# EasyEDA Pro project tc264核心板miniv3.1.epro

# Schematic Schematic3
Board Name: 芯片小板; Create Date: 2025-07-16; Page Name: P1; Project Name: tc264芯片小板; Schematic Name: Schematic3; Update Date: 2025-07-17; Company: 嘉立创EDA; Page Size: A4; Version: V1.0
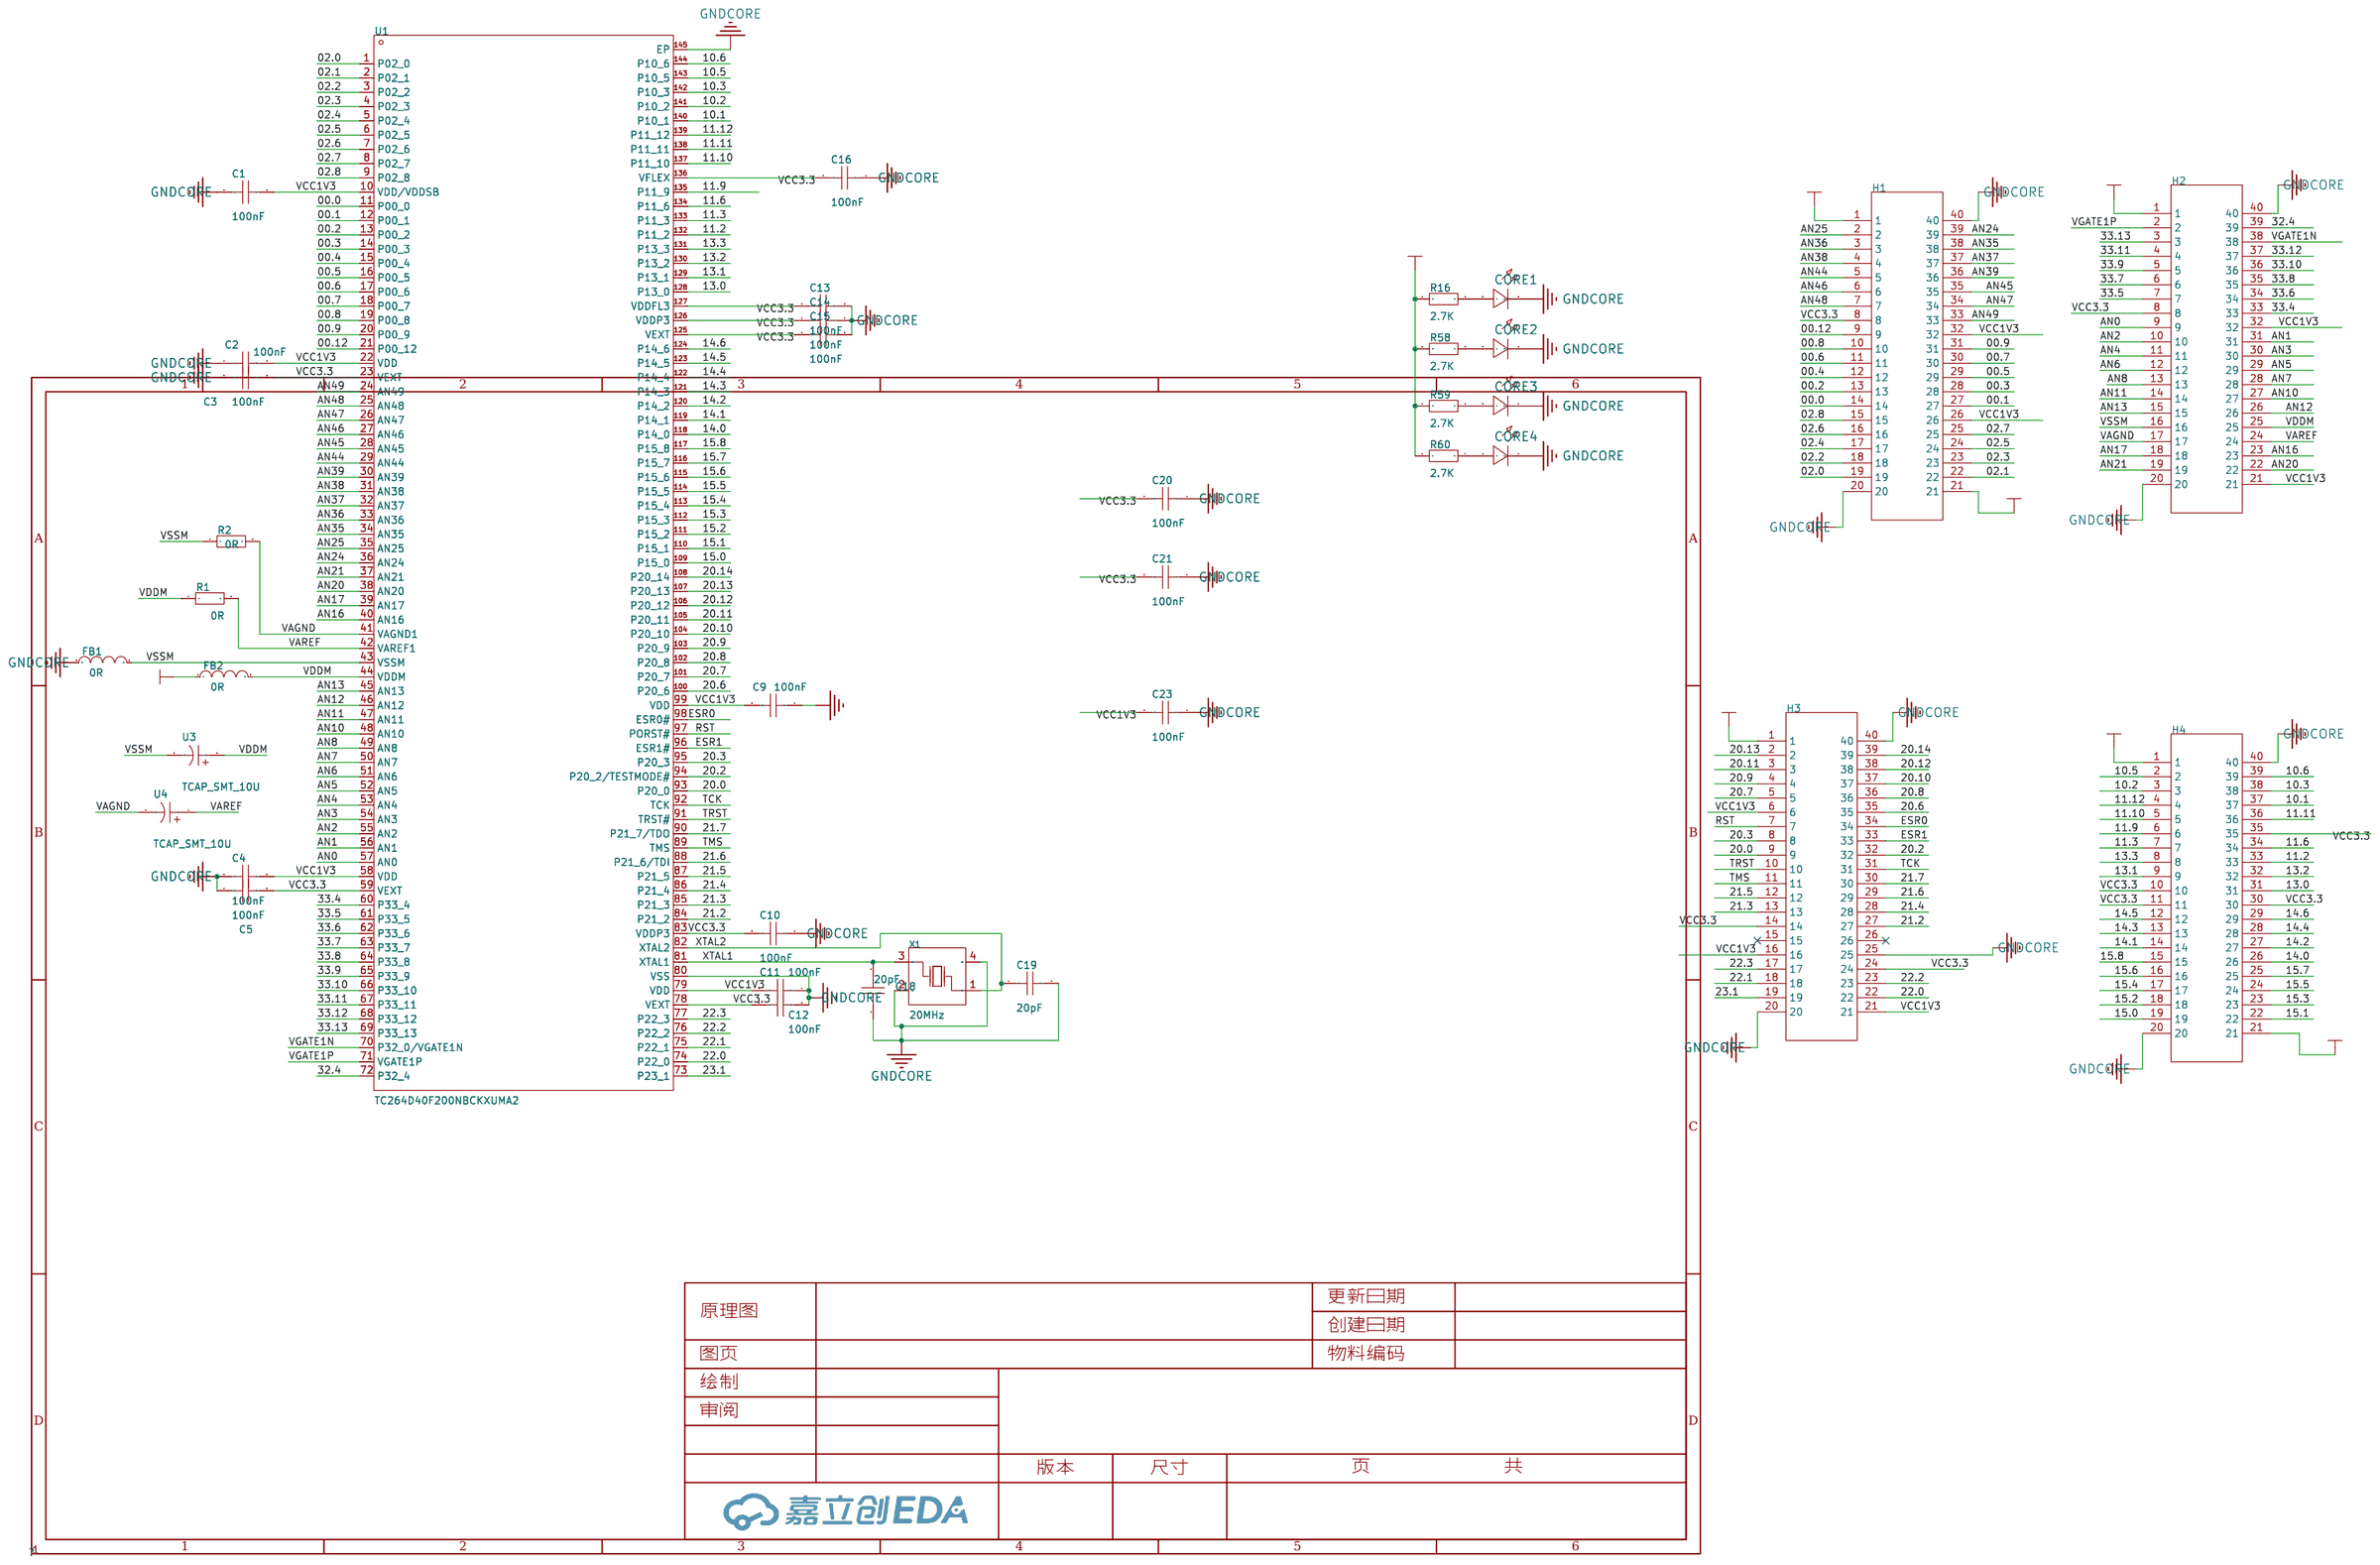
[diagram p0: schematic sheet]

## Parts
C1  100nF  [C0603]
C2  100nF  [C0603]
C3  100nF  [C0603]
C4  100nF  [C0603]
C5  100nF  [C0603]
C9  100nF  [C0603]
C10  100nF  [C0603]
C11  100nF  [C0603]
C12  100nF  [C0603]
C13  100nF  [C0603]
C14  100nF  [C0603]
C15  100nF  [C0603]
C16  100nF  [C0603]
C18  20pF  [C0603]
C19  20pF  [C0603]
C20  100nF  [C0603]
C21  100nF  [C0603]
C23  100nF  [C0603]
CORE1  -  [LED_0603]
CORE2  -  [LED_0603]
CORE3  -  [LED_0603]
CORE4  -  [LED_0603]
FB1  0R  [L0603]
FB2  0R  [L0603]
H1  -  [HEADER_0.8mm_2x20P_G]
H2  -  [HEADER_0.8mm_2x20P_G]
H3  -  [HEADER_0.8mm_2x20P_G]
H4  -  [HEADER_0.8mm_2x20P_G]
R1  0R  [R0603]
R2  0R  [R0603]
R16  2.7K  [R0603]
R58  2.7K  [R0603]
R59  2.7K  [R0603]
R60  2.7K  [R0603]
U1  TC264D40F200NBCKXUMA2  [LQFP-144_L20.0-W20.0-P0.50-LS22.0-BL-EP6.7]
U3  TCAP_SMT_10U  [CAP-SMD_L3.2-W1.6-FD-1]
U4  TCAP_SMT_10U  [CAP-SMD_L3.2-W1.6-FD-1]
X1  20MHz  [OSC-SMD_4P-L3.2-W2.5-BL]

## Library data of the parts
C1-C5 C9-C16 C18-C21 C23 = CAP_0603: Supplier Footprint: 0603
CORE1-CORE4 = LED_0603-R: Supplier Footprint: 0603
FB1 FB2 = BLM18PG121SN1D: 标称阻抗@测试频率:120Ω@100MHz;误差:±25%;直流电阻(RDC):50mΩ;额定电流:2A;电路数:1;; LCSC Part Name: 120Ω@100MHz ±25%; Supplier Part: C14709; Manufacturer: muRata(村田); Supplier Footprint: 0603; JLCPCB Part Class: 扩展库; Datasheet: https://atta.szlcsc.com/upload/public/pdf/source/20130704/1457706621134.pdf; Supplier: LCSC; Impedance @ Frequency: 120Ω@100MHz; Tolerance: ±25%; DC Resistance: 50mΩ; Current Rating: 2A; Circuits: 1
H1-H4 = HEADER_0.8mm_2x20P_G
R1 R2 R16 R58-R60 = Res_0603: Supplier Footprint: 0603
U1 = TC264D40F200NBCKXUMA2: CPU内核:其他系列;CPU最大主频:20MHz;工作电压范围:3.3V~5V;GPIO端口数量:88;; Supplier Part: C3232186; Manufacturer: Infineon(英飞凌); Supplier Footprint: LQFP-144-EP(20x20); JLCPCB Part Class: 扩展库; Supplier: LCSC; CPU Core: 其他系列; CPU Maximum Speed: 20MHz; Operating Voltage Range: 3.3V~5V; GPIO Ports Number: 88; ADC (Bit): 12bit; Secure Digital Input and Output: 有; Operating Temperature Range: -40℃~+125℃
U3 U4 = TCAP_SMT_10U: Supplier Part: C9900021659; Supplier Footprint: 钽电容1206; JLCPCB Part Class: 扩展库; Supplier: LCSC
X1 = X322512MSB4SI: 频率:12MHz;频率公差:±10ppm;负载电容:20pF;; LCSC Part Name: 12MHz ±10ppm 20pF YSX321SL; Supplier Part: C9002; Manufacturer: YXC(扬兴晶振); Supplier Footprint: SMD3225-4P; JLCPCB Part Class: 基础库; Datasheet: https://atta.szlcsc.com/upload/public/pdf/source/20210329/C112971_1F611BDC486E193C1706F6D8EB5AA189.pdf; Supplier: LCSC; Crystal Type: 贴片无源晶振; Frequency Tolerance: ±10ppm; Frequency Stability: ±30ppm; Load Capacitance: 20pF; Operating Temperature: -40℃~+85℃

## Nets
GNDCORE: C1.1 C2.1 C3.1 C4.1 C5.1 C9.1 C10.1 C11.1 C12.1 C13.1 C14.1 C15.1 C16.1 C18.1 C19.2 C20.1 C21.1 C23.1 CORE1.1(C) CORE2.1(C) CORE3.1(C) CORE4.1(C) FB1.1 H1.20 H1.40 H2.20 H2.40 H3.20 H3.25 H3.40 H4.20 H4.40 U1.80(VSS) U1.145(EP) X1.2(GND) X1.4(GND)
VCC1V3: C1.2 C2.2 C4.2 C9.2 C11.2 C23.2 H1.26 H1.32 H2.1 H2.21 H2.32 H3.6 H3.16 H3.21 U1.10(VDD/VDDSB) U1.22(VDD) U1.58(VDD) U1.79(VDD) U1.99(VDD)
VCC3.3: C3.2 C5.2 C10.2 C12.2 C13.2 C14.2 C15.2 C16.2 C20.2 C21.2 FB2.1 H1.1 H1.8 H1.21 H2.8 H3.1 H3.14 H3.24 H4.1 H4.10 H4.11 H4.21 H4.30 H4.35 R16.1 R58.1 R59.1 R60.1 U1.23(VEXT) U1.59(VEXT) U1.78(VEXT) U1.83(VDDP3) U1.125(VEXT) U1.126(VDDP3) U1.127(VDDFL3) U1.136(VFLEX)
VDDM: FB2.2 H2.25 R1.1 U1.44(VDDM) U3.1
VSSM: FB1.2 H2.16 R2.1 U1.43(VSSM) U3.2
00.0: H1.14 U1.11(P00_0)
00.1: H1.27 U1.12(P00_1)
00.2: H1.13 U1.13(P00_2)
00.3: H1.28 U1.14(P00_3)
00.4: H1.12 U1.15(P00_4)
00.5: H1.29 U1.16(P00_5)
00.6: H1.11 U1.17(P00_6)
00.7: H1.30 U1.18(P00_7)
00.8: H1.10 U1.19(P00_8)
00.9: H1.31 U1.20(P00_9)
00.12: H1.9 U1.21(P00_12)
02.0: H1.19 U1.1(P02_0)
02.1: H1.22 U1.2(P02_1)
02.2: H1.18 U1.3(P02_2)
02.3: H1.23 U1.4(P02_3)
02.4: H1.17 U1.5(P02_4)
02.5: H1.24 U1.6(P02_5)
02.6: H1.16 U1.7(P02_6)
02.7: H1.25 U1.8(P02_7)
02.8: H1.15 U1.9(P02_8)
10.1: H4.37 U1.140(P10_1)
10.2: H4.3 U1.141(P10_2)
10.3: H4.38 U1.142(P10_3)
10.5: H4.2 U1.143(P10_5)
10.6: H4.39 U1.144(P10_6)
11.2: H4.33 U1.132(P11_2)
11.3: H4.7 U1.133(P11_3)
11.6: H4.34 U1.134(P11_6)
11.9: H4.6 U1.135(P11_9)
11.10: H4.5 U1.137(P11_10)
11.11: H4.36 U1.138(P11_11)
11.12: H4.4 U1.139(P11_12)
13.0: H4.31 U1.128(P13_0)
13.1: H4.9 U1.129(P13_1)
13.2: H4.32 U1.130(P13_2)
13.3: H4.8 U1.131(P13_3)
14.0: H4.26 U1.118(P14_0)
14.1: H4.14 U1.119(P14_1)
14.2: H4.27 U1.120(P14_2)
14.3: H4.13 U1.121(P14_3)
14.4: H4.28 U1.122(P14_4)
14.5: H4.12 U1.123(P14_5)
14.6: H4.29 U1.124(P14_6)
15.0: H4.19 U1.109(P15_0)
15.1: H4.22 U1.110(P15_1)
15.2: H4.18 U1.111(P15_2)
15.3: H4.23 U1.112(P15_3)
15.4: H4.17 U1.113(P15_4)
15.5: H4.24 U1.114(P15_5)
15.6: H4.16 U1.115(P15_6)
15.7: H4.25 U1.116(P15_7)
15.8: H4.15 U1.117(P15_8)
20.0: H3.9 U1.93(P20_0)
20.2: H3.32 U1.94(P20_2/TESTMODE#)
20.3: H3.8 U1.95(P20_3)
20.6: H3.35 U1.100(P20_6)
20.7: H3.5 U1.101(P20_7)
20.8: H3.36 U1.102(P20_8)
20.9: H3.4 U1.103(P20_9)
20.10: H3.37 U1.104(P20_10)
20.11: H3.3 U1.105(P20_11)
20.12: H3.38 U1.106(P20_12)
20.13: H3.2 U1.107(P20_13)
20.14: H3.39 U1.108(P20_14)
21.2: H3.27 U1.84(P21_2)
21.3: H3.13 U1.85(P21_3)
21.4: H3.28 U1.86(P21_4)
21.5: H3.12 U1.87(P21_5)
21.6: H3.29 U1.88(P21_6/TDI)
21.7: H3.30 U1.90(P21_7/TDO)
22.0: H3.22 U1.74(P22_0)
22.1: H3.18 U1.75(P22_1)
22.2: H3.23 U1.76(P22_2)
22.3: H3.17 U1.77(P22_3)
23.1: H3.19 U1.73(P23_1)
32.4: H2.39 U1.72(P32_4)
33.4: H2.33 U1.60(P33_4)
33.5: H2.7 U1.61(P33_5)
33.6: H2.34 U1.62(P33_6)
33.7: H2.6 U1.63(P33_7)
33.8: H2.35 U1.64(P33_8)
33.9: H2.5 U1.65(P33_9)
33.10: H2.36 U1.66(P33_10)
33.11: H2.4 U1.67(P33_11)
33.12: H2.37 U1.68(P33_12)
33.13: H2.3 U1.69(P33_13)
AN0: H2.9 U1.57(AN0)
AN1: H2.31 U1.56(AN1)
AN2: H2.10 U1.55(AN2)
AN3: H2.30 U1.54(AN3)
AN4: H2.11 U1.53(AN4)
AN5: H2.29 U1.52(AN5)
AN6: H2.12 U1.51(AN6)
AN7: H2.28 U1.50(AN7)
AN8: H2.13 U1.49(AN8)
AN10: H2.27 U1.48(AN10)
AN11: H2.14 U1.47(AN11)
AN12: H2.26 U1.46(AN12)
AN13: H2.15 U1.45(AN13)
AN16: H2.23 U1.40(AN16)
AN17: H2.18 U1.39(AN17)
AN20: H2.22 U1.38(AN20)
AN21: H2.19 U1.37(AN21)
AN24: H1.39 U1.36(AN24)
AN25: H1.2 U1.35(AN25)
AN35: H1.38 U1.34(AN35)
AN36: H1.3 U1.33(AN36)
AN37: H1.37 U1.32(AN37)
AN38: H1.4 U1.31(AN38)
AN39: H1.36 U1.30(AN39)
AN44: H1.5 U1.29(AN44)
AN45: H1.35 U1.28(AN45)
AN46: H1.6 U1.27(AN46)
AN47: H1.34 U1.26(AN47)
AN48: H1.7 U1.25(AN48)
AN49: H1.33 U1.24(AN49)
ESR0: H3.34 U1.98(ESR0#)
ESR1: H3.33 U1.96(ESR1#)
RST: H3.7 U1.97(PORST#)
TCK: H3.31 U1.92(TCK)
TMS: H3.11 U1.89(TMS)
TRST: H3.10 U1.91(TRST#)
VAGND: H2.17 R2.2 U1.41(VAGND1) U4.2
VAREF: H2.24 R1.2 U1.42(VAREF1) U4.1
VGATE1N: H2.38 U1.70(P32_0/VGATE1N)
VGATE1P: H2.2 U1.71(VGATE1P)
XTAL1: C18.2 U1.81(XTAL1) X1.3(OSC2)
XTAL2: C19.1 U1.82(XTAL2) X1.1(OSC1)
$1N2544: CORE1.2(A) R16.2
$1N12255: CORE2.2(A) R58.2
$1N12320: CORE3.2(A) R59.2
$1N12385: CORE4.2(A) R60.2

Not connected (* = marked no-connect by the designer): H3 15* 26*

# Board PCB8
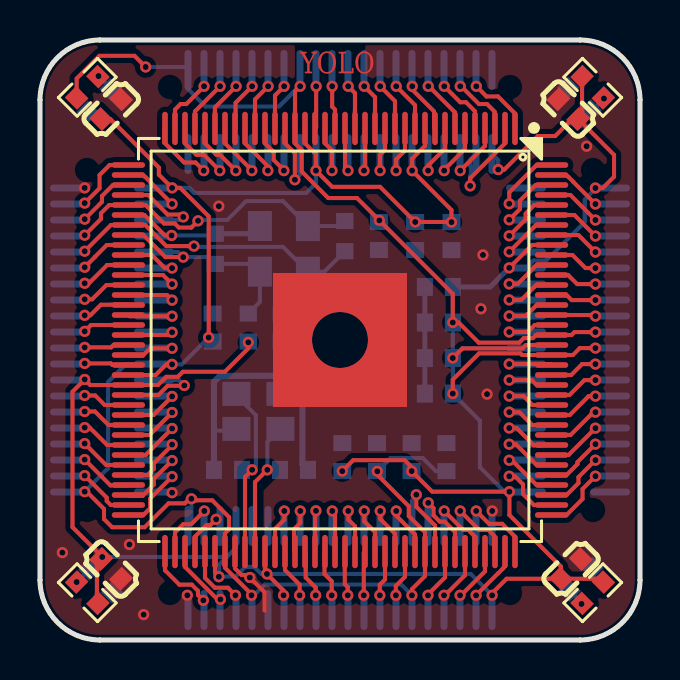
[diagram p1: board, top side]
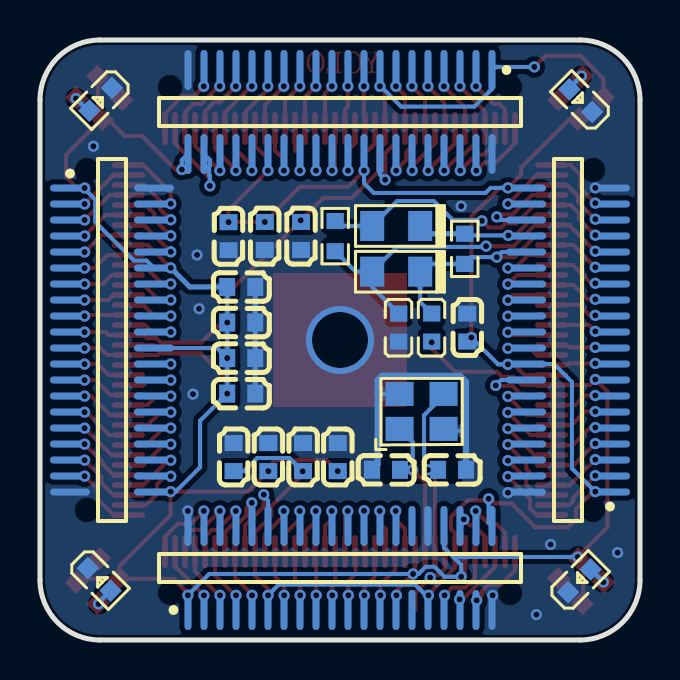
[diagram p2: board, bottom side, seen from below]

Outline 30 x 30 mm; copper layers: Top Layer, Bottom Layer. Coordinates in mm from the lower left corner of the outline.
Outline path: 0,27 0,3 arc(0.88,0.88) 3,0 27,0 arc(29.12,0.88) 30,3 30,27 arc(29.12,29.12) 27,30 3,30 arc(0.88,29.12) 0,27
Stack: Top Layer 0.035mm / Dielectric1 1.51mm FR4 er 4.5 / Bottom Layer 0.035mm

## Design rules (mm)
template: 自定义配置
spacing copperThickness1oz (default): track to track 0.102, other pairs 0.152 to 0.3
spacing copperThickness2oz: track to track 0.203, other pairs 0.152 to 0.3
track width copperThickness1oz (default): min 0.127, default 0.203, max 2.54
track width copperThickness2oz: min 0.203, default 0.254, max 2.54
differential pair differentialPair (default): width min 0.127, default 0.254, max 2.54; gap min 0.152, default 0.152
via viaSize (default): diameter min 0.5, default 0.559, max 10; hole min 0.3, default 0.305, max 6.299

## Placement (name value [footprint] x y rotation side)
C1  100nF  [C0603]  20.57 20.19 90 bottom
C2  100nF  [C0603]  18.76 20.2 90 bottom
C3  100nF  [C0603]  16.95 20.2 90 bottom
C4  100nF  [C0603]  8.64 15.62 270 bottom
C5  100nF  [C0603]  3.56 3.56 135 top
C9  100nF  [C0603]  20.32 9.14 270 bottom
C10  100nF  [C0603]  18.58 9.14 270 bottom
C11  100nF  [C0603]  16.85 9.14 270 bottom
C12  100nF  [C0603]  15.11 9.14 270 bottom
C13  100nF  [C0603]  19.94 12.32 0 bottom
C14  100nF  [C0603]  19.94 14.1 0 bottom
C15  100nF  [C0603]  19.94 15.88 0 bottom
C16  100nF  [C0603]  19.94 17.65 0 bottom
C18  20pF  [C0603]  9.4 8.51 0 bottom
C19  20pF  [C0603]  12.7 8.51 0 bottom
C20  100nF  [C0603]  26.54 3.56 225 top
C21  100nF  [C0603]  26.42 26.54 315 top
C23  100nF  [C0603]  3.56 26.54 225 top
CORE1  -  [LED_0603]  3 3 135 bottom
CORE2  -  [LED_0603]  27 27 315 bottom
CORE3  -  [LED_0603]  27 3 225 bottom
CORE4  -  [LED_0603]  3 27 44.9 bottom
FB1  0R  [L0603]  12.06 15.62 90 bottom
FB2  0R  [L0603]  10.41 15.62 90 bottom
H1  -  [HEADER_0.8mm_2x20P_G]  15 26.4 270 bottom
H2  -  [HEADER_0.8mm_2x20P_G]  3.6 15 0 bottom
H3  -  [HEADER_0.8mm_2x20P_G]  15 3.6 90 bottom
H4  -  [HEADER_0.8mm_2x20P_G]  26.4 15 180 bottom
R1  0R  [R0603]  8.76 19.56 90 bottom
R2  0R  [R0603]  15.24 20.19 90 bottom
R16  2.7K  [R0603]  2.37 2.36 135 top
R58  2.7K  [R0603]  27.63 27.64 315 top
R59  2.7K  [R0603]  27.63 2.36 225 top
R60  2.7K  [R0603]  2.37 27.64 45 top
U1  TC264D40F200NBCKXUMA2  [LQFP-144_L20.0-W20.0-P0.50-LS22.0-BL-EP6.7]  15 15 180 top
U3  TCAP_SMT_10U  [CAP-SMD_L3.2-W1.6-FD-1]  12.19 18.42 0 bottom
U4  TCAP_SMT_10U  [CAP-SMD_L3.2-W1.6-FD-1]  12.19 20.7 0 bottom
X1  20MHz  [OSC-SMD_4P-L3.2-W2.5-BL]  10.92 11.43 180 bottom

## Footprints (pads in the part's own frame, mm; a bottom-side part is the same pattern mirrored in y, then rotated)
C0603
  rect 0.8x0.9 smd: 1(-0.7,0) 2(0.7,0)
CAP-SMD_L3.2-W1.6-FD-1
  rect 1.2x1.5 smd: 1(-1.2,0) 2(1.2,0)
HEADER_0.8mm_2x20P_G
  oval 2x0.35 smd: 1(-2.1,7.6) 2(-2.1,6.8) 3(-2.1,6) 4(-2.1,5.2) 5(-2.1,4.4) 6(-2.1,3.6) 7(-2.1,2.8) 8(-2.1,2) 9(-2.1,1.2) 10(-2.1,0.4) 11(-2.1,-0.4) 12(-2.1,-1.2) 13(-2.1,-2) 14(-2.1,-2.8) 15(-2.1,-3.6) 16(-2.1,-4.4) 17(-2.1,-5.2) 18(-2.1,-6) 19(-2.1,-6.8) 20(-2.1,-7.6) 21(2.1,-7.6) 22(2.1,-6.8) 23(2.1,-6) 24(2.1,-5.2) 25(2.1,-4.4) 26(2.1,-3.6) 27(2.1,-2.8) 28(2.1,-2) 29(2.1,-1.2) 30(2.1,-0.4) 31(2.1,0.4) 32(2.1,1.2) 33(2.1,2) 34(2.1,2.8) 35(2.1,3.6) 36(2.1,4.4) 37(2.1,5.2) 38(2.1,6) 39(2.1,6.8) 40(2.1,7.6)
L0603
  rect 0.8x0.864 smd: 1(-0.7,0) 2(0.7,0)
LED_0603
  rect 0.8x0.8 smd: 1(-0.851,-0.01) 2(0.75,-0.005)
LQFP-144_L20.0-W20.0-P0.50-LS22.0-BL-EP6.7
  oval 0.28x1.66 smd: 1(-8.75,-10.58) 2(-8.25,-10.58) 3(-7.75,-10.58) 4(-7.25,-10.58) 5(-6.75,-10.58) 6(-6.25,-10.58) 7(-5.75,-10.58) 8(-5.25,-10.58) 9(-4.75,-10.58) 10(-4.25,-10.58) 11(-3.75,-10.58) 12(-3.25,-10.58) 13(-2.75,-10.58) 14(-2.25,-10.58) 15(-1.75,-10.58) 16(-1.25,-10.58) 17(-0.75,-10.58) 18(-0.25,-10.58) 19(0.25,-10.58) 20(0.75,-10.58) 21(1.25,-10.58) 22(1.75,-10.58) 23(2.25,-10.58) 24(2.75,-10.58) 25(3.25,-10.58) 26(3.75,-10.58) 27(4.25,-10.58) 28(4.75,-10.58) 29(5.25,-10.58) 30(5.75,-10.58) 31(6.25,-10.58) 32(6.75,-10.58) 33(7.25,-10.58) 34(7.75,-10.58) 35(8.25,-10.58) 36(8.75,-10.58) 73(8.75,10.58) 74(8.25,10.58) 75(7.75,10.58) 76(7.25,10.58) 77(6.75,10.58) 78(6.25,10.58) 79(5.75,10.58) 80(5.25,10.58) 81(4.75,10.58) 82(4.25,10.58) 83(3.75,10.58) 84(3.25,10.58) 85(2.75,10.58) 86(2.25,10.58) 87(1.75,10.58) 88(1.25,10.58) 89(0.75,10.58) 90(0.25,10.58) 91(-0.25,10.58) 92(-0.75,10.58) 93(-1.25,10.58) 94(-1.75,10.58) 95(-2.25,10.58) 96(-2.75,10.58) 97(-3.25,10.58) 98(-3.75,10.58) 99(-4.25,10.58) 100(-4.75,10.58) 101(-5.25,10.58) 102(-5.75,10.58) 103(-6.25,10.58) 104(-6.75,10.58) 105(-7.25,10.58) 106(-7.75,10.58) 107(-8.25,10.58) 108(-8.75,10.58)
  oval 1.66x0.28 smd: 37(10.58,-8.75) 38(10.58,-8.25) 39(10.58,-7.75) 40(10.58,-7.25) 41(10.58,-6.75) 42(10.58,-6.25) 43(10.58,-5.75) 44(10.58,-5.25) 45(10.58,-4.75) 46(10.58,-4.25) 47(10.58,-3.75) 48(10.58,-3.25) 49(10.58,-2.75) 50(10.58,-2.25) 51(10.58,-1.75) 52(10.58,-1.25) 53(10.58,-0.75) 54(10.58,-0.25) 55(10.58,0.25) 56(10.58,0.75) 57(10.58,1.25) 58(10.58,1.75) 59(10.58,2.25) 60(10.58,2.75) 61(10.58,3.25) 62(10.58,3.75) 63(10.58,4.25) 64(10.58,4.75) 65(10.58,5.25) 66(10.58,5.75) 67(10.58,6.25) 68(10.58,6.75) 69(10.58,7.25) 70(10.58,7.75) 71(10.58,8.25) 72(10.58,8.75) 109(-10.58,8.75) 110(-10.58,8.25) 111(-10.58,7.75) 112(-10.58,7.25) 113(-10.58,6.75) 114(-10.58,6.25) 115(-10.58,5.75) 116(-10.58,5.25) 117(-10.58,4.75) 118(-10.58,4.25) 119(-10.58,3.75) 120(-10.58,3.25) 121(-10.58,2.75) 122(-10.58,2.25) 123(-10.58,1.75) 124(-10.58,1.25) 125(-10.58,0.75) 126(-10.58,0.25) 127(-10.58,-0.25) 128(-10.58,-0.75) 129(-10.58,-1.25) 130(-10.58,-1.75) 131(-10.58,-2.25) 132(-10.58,-2.75) 133(-10.58,-3.25) 134(-10.58,-3.75) 135(-10.58,-4.25) 136(-10.58,-4.75) 137(-10.58,-5.25) 138(-10.58,-5.75) 139(-10.58,-6.25) 140(-10.58,-6.75) 141(-10.58,-7.25) 142(-10.58,-7.75) 143(-10.58,-8.25) 144(-10.58,-8.75)
  rect 6.7x6.7 smd: 145(0,0)
OSC-SMD_4P-L3.2-W2.5-BL
  rect 1.4x1.2 smd: 1(-1.1,-0.875) 2(1.1,-0.875) 3(1.1,0.875) 4(-1.1,0.875)
R0603
  rect 0.806x0.864 smd: 1(-0.753,0) 2(0.753,0)

## Nets
As in the schematic.

Pads without a net: H3 15 26

## Via types
v1: diameter 0.559, hole 0.305, Top Layer to Bottom Layer, 182 vias
v2: diameter 3.4, hole 2.8, Top Layer to Bottom Layer, 1 via

## Routing (per net, layer and track width the routed paths; a pad name or vN(x,y) marks a point on that pad's centre or on a via; arc(x,y) is an arc through that point)
GNDCORE: length 27.2
  Top Layer w0.203: 11.23,1.47 11.23,2.39 v1(10.49,3.12) 10.37,3.25 10.08,3.25 9.75,3.58 U1.80
  Bottom Layer w0.203: v1(7.37,2.23) 7.4,2.2 H3.20 ; 13.12,12.31 13.12,12.31 X1.4 ; 8.7,10.46 9.73,10.46 X1.2 ; v1(22.61,6.45) 22.61,5.71 H3.40
  Bottom Layer w0.254: v1(2.24,22.61) 2.23,22.6 H2.20 ; C16.1 C15.1 C14.1 C13.1
  Bottom Layer w0.305: C19.2 13.12,8.79 13.12,12.99 12.9,13.21 9,13.21 8.7,12.91 C18.1
  vias: v1(1.12,4.37) v1(4.47,4.78) v1(5.18,1.27) v1(6.6,7.37) v1(8.94,21.69) v1(22.05,16.56) v1(22.15,19.25) v1(22.35,12.29) v1(27.33,24.69) v2(15,15)
VCC1V3: length 90.4
  Top Layer w0.203: v1(8.43,15.12) 8.44,15.13 8.44,21.18 7.01,22.61 v1(6.6,22.61) 5.94,23.27 5.94,23.62 3.52,26.05 3.06,26.05 ; v1(6.6,13.78) 6.31,13.78 5.78,13.25 U1.58 ; 7.49,7.04 7.54,7.04 v1(7.57,7.06) ; 7.49,7.04 7.44,6.98 ; 7.49,7.04 7.44,7.04 ; 7.44,7.04 7.24,6.83 6.43,6.83 5.23,5.64 3.61,5.64 3.2,6.05 3.2,6.55 2.34,7.42 v1(2.24,7.42) ; 7.44,7.04 7.44,6.98 ; v1(18.6,2.23) 18.6,2.54 19.25,3.2 U1.99 19.25,5.39 18.44,6.2 18.44,6.69 16.87,8.26 v1(16.87,8.43) ; 7.44,6.98 8.61,6.98 9.45,6.14 9.45,5.54 9.25,5.34 U1.79 9.25,3.61 10.57,2.29 v1(10.57,2.23) ; U1.10 19.25,24.71 18.61,24.07 v1(18.61,23.47) 20.57,21.5 v1(20.57,20.89) 20.57,20.9 v1(18.76,20.9) 17,22.66 14.61,22.66 v1(13.8,23.47) 13.8,24.29 13.25,24.83 U1.22
  Bottom Layer w0.203: H1.26 18.61,24.29 v1(18.61,23.47) ; v1(8.43,15.12) 7.09,13.78 v1(6.6,13.78) ; H3.16 10.6,2.21 v1(10.57,2.23) 10.7,2.23 11.24,2.77 18.06,2.77 v1(18.6,2.23) 18.6,2.23 H3.6 ; v1(7.57,7.06) 7.57,5.87 H3.21 ; C11.2 16.85,8.44 v1(16.87,8.43) 17.53,9.1 19.14,9.1 19.79,8.44 C9.2 ; H2.32 4.3,13.8 3.4,12.9 3.4,8.58 v1(2.24,7.42) ; H1.32 13.8,23.47 v1(13.8,23.47) 13.8,22.84 13.31,22.35 7.72,22.35 7.47,22.61 v1(6.6,22.61)
  Bottom Layer w0.254: H2.1 2.22,7.4 v1(2.24,7.42)
VCC3.3: length 166.8
  Top Layer w0.203: 12.75,24.92 12.75,24.84 13.09,24.5 13.09,23.42 14.41,22.1 15.85,22.1 v1(16.97,20.98) 20.64,17.31 v1(20.64,15.88) 20.93,15.88 21.93,14.87 23.96,14.87 24.19,15.1 24.65,15.1 24.8,15.25 U1.127 26.58,15.25 26.72,15.39 v1(27.77,15.39) ; R60.1 1.83,28.07 2.97,29.21 4.72,29.21 v1(5.28,28.65) ; U1.136 24.6,19.75 v1(23.46,18.61) ; v1(8.94,3.16) 8.75,3.36 U1.78 ; 26.91,26.05 26.61,26.05 25.76,25.2 24.89,25.2 23.22,23.52 v1(22.91,23.52) ; 26.91,26.05 28.7,24.26 28.7,23.17 28.14,22.6 v1(27.77,22.6) ; 26.91,26.05 27.1,26.24 R58.1 ; R16.1 2.84,1.89 2.84,3.89 v1(3.11,4.15) 1.63,5.64 1.63,12.42 v1(2.24,13.03) 2.51,12.75 U1.59 5.9,12.75 6.31,13.16 6.89,13.16 7.14,13.41 9.25,13.41 10.41,14.58 v1(10.41,14.88) ; 26.05,3.06 23.32,3.06 22.55,2.29 v1(22.61,2.23) ; 26.05,3.06 26.05,3.67 23.47,6.25 v1(23.47,7.42) 19.61,7.42 v1(18.58,8.44) 18.58,8.64 18.24,8.99 15.66,8.99 v1(15.11,8.44) ; 26.05,3.06 28,3.06 R59.1 ; v1(12.18,2.23) 12.18,2.47 v1(11.35,3.3) 11.25,3.4 U1.83 ; U1.126 24.3,14.75 24.13,14.58 21.12,14.58 v1(20.64,14.1) ; U1.23 12.75,27.43 v1(13.01,27.69) ; v1(27.77,14.59) 26.99,14.59 26.65,14.25 U1.125 24.1,14.25 24.02,14.33 21.95,14.33 20.64,13.02 v1(20.64,12.32)
  Bottom Layer w0.203: v1(23.46,18.61) 24.29,18.61 H4.35 24.67,18.97 25.3,18.97 27.24,20.91 27.24,22.02 27.77,22.55 v1(27.77,22.6) ; H4.30 21.14,14.6 v1(20.64,14.1) ; 9.33,4.15 8.94,3.76 v1(8.94,3.16) 9.78,3.16 10.27,3.66 10.71,3.66 11.07,3.3 v1(11.35,3.3) 21.54,3.3 v1(22.61,2.23) 22.61,1.51 H3.1 ; 9.33,4.15 v1(3.11,4.15) ; 9.33,4.15 9.8,4.62 H3.24 ; v1(20.64,14.1) v1(20.64,12.32) 22,10.96 22,8.64 23.22,7.42 v1(23.47,7.42) ; v1(20.64,14.1) v1(20.64,15.88) 20.64,17.65 ; H3.14 12.2,2.21 v1(12.18,2.23) ; H4.10 28.5,15.39 v1(27.77,15.39) ; H4.11 28.5,14.59 v1(27.77,14.59) ; H1.21 22.91,23.99 v1(22.91,23.52) ; v1(5.28,28.65) 7.25,28.65 H1.1 7.4,27.55 8.28,26.67 11.94,26.67 12.96,27.69 v1(13.01,27.69) 13.01,28.49 H1.8
  Bottom Layer w0.254: H2.8 2.21,13 v1(2.24,13.03) ; v1(23.46,18.61) 22.51,17.65 20.64,17.65
VDDM: length 11.2
  Top Layer w0.203: v1(7.16,19.14) 6.27,19.14 5.17,20.25 U1.44
  Bottom Layer w0.203: FB2.2 10.99,16.9 U3.1 10.6,18.8 R1.1 8.42,19.14 v1(7.16,19.14) 6.91,19.4 H2.25
VSSM: length 18.4
  Top Layer w0.203: v1(7.7,19.69) 6.32,19.69 5.26,20.75 U1.43 3.55,20.75 v1(2.24,19.44)
  Bottom Layer w0.203: U3.2 13.39,17.65 FB1.2 ; U3.2 14.22,18.42 R2.1 ; U3.2 12.15,19.65 7.7,19.65 v1(7.7,19.69)
  Bottom Layer w0.254: H2.16 2.2,19.4 v1(2.24,19.44)
00.0: length 3.3
  Top Layer w0.203: v1(17.81,27.69) 18.75,26.75 U1.11
  Bottom Layer w0.203: v1(17.81,27.69) 17.81,28.49 H1.14
00.1: length 3.1
  Top Layer w0.203: v1(17.8,23.47) 17.8,24.03 18.25,24.47 U1.12
  Bottom Layer w0.203: H1.27 17.8,24.3 v1(17.8,23.47)
00.2: length 3.2
  Top Layer w0.203: v1(17.01,27.69) 17.75,26.95 U1.13
  Bottom Layer w0.203: H1.13 17.01,28.49 v1(17.01,27.69)
00.3: length 3
  Top Layer w0.203: v1(17,23.47) 17,24.26 17.25,24.5 U1.14
  Bottom Layer w0.203: v1(17,23.47) 17,24.3 H1.28
00.4: length 3.1
  Top Layer w0.203: v1(16.21,27.69) 16.75,27.15 U1.15
  Bottom Layer w0.203: H1.12 16.21,28.49 v1(16.21,27.69)
00.5: length 3
  Top Layer w0.203: U1.16 16.25,23.52 v1(16.2,23.47)
  Bottom Layer w0.203: v1(16.2,23.47) H1.29
00.6: length 3.1
  Top Layer w0.203: U1.17 15.75,25.58 15.75,27.35 v1(15.41,27.69)
  Bottom Layer w0.203: v1(15.41,27.69) 15.41,28.49 H1.11
00.7: length 3
  Top Layer w0.203: U1.18 15.25,23.62 v1(15.4,23.47)
  Bottom Layer w0.203: v1(15.4,23.47) H1.30
00.8: length 2.2
  Top Layer w0.203: U1.19 14.75,26.53 14.61,26.67 v1(14.61,27.69)
00.9: length 3.1
  Top Layer w0.203: v1(14.6,23.47) 14.6,24.48 14.25,24.83 U1.20
  Bottom Layer w0.203: 14.6,23.47 H1.31
00.12: length 2.9
  Top Layer w0.203: v1(13.81,27.69) 13.81,25.64 U1.21
  Bottom Layer w0.203: H1.9 13.81,28.49 v1(13.81,27.69)
02.0: length 4.1
  Top Layer w0.203: U1.1 23.75,26.33 22.9,27.18 22.32,27.18 v1(21.81,27.69)
  Bottom Layer w0.203: H1.19 21.81,28.49 v1(21.81,27.69)
02.1: length 5.3
  Top Layer w0.203: v1(21.51,22.71) 21.51,23.09 23.25,24.83 U1.2
  Bottom Layer w0.203: H1.22 21.51,24.01 21.51,23.72 21.54,23.69 21.54,23.25 21.51,23.21 v1(21.51,22.71)
02.2: length 3.9
  Top Layer w0.203: v1(21.01,27.69) 21.06,27.69 21.95,26.8 22.35,26.8 22.73,26.42 22.73,25.6 U1.3
  Bottom Layer w0.203: H1.18 21.01,28.49 v1(21.01,27.69)
02.3: length 3.5
  Top Layer w0.203: v1(21.01,23.47) 22.25,24.71 U1.4
  Bottom Layer w0.203: H1.23 21.01,24.29 v1(21.01,23.47)
02.4: length 3.7
  Top Layer w0.203: U1.5 21.75,26.44 21.3,26.89 21.01,26.89 v1(20.21,27.69)
  Bottom Layer w0.203: v1(20.21,27.69) 20.21,28.49 H1.17
02.5: length 3.4
  Top Layer w0.203: 20.18,23.44 20.18,23.48 21.25,24.55 U1.6
  Bottom Layer w0.203: H1.24 20.21,24.29 v1(20.21,23.47)
02.6: length 3.5
  Top Layer w0.203: v1(19.41,27.69) 19.45,27.69 20.75,26.38 U1.7
  Bottom Layer w0.203: H1.16 19.41,28.49 v1(19.41,27.69)
02.7: length 3.3
  Top Layer w0.203: v1(19.41,23.47) 19.41,23.72 20.25,24.57 U1.8
  Bottom Layer w0.203: H1.25 19.41,24.29 v1(19.41,23.47)
02.8: length 3.4
  Top Layer w0.203: 18.61,27.52 18.61,27.49 ; 18.61,27.52 19.7,26.43 19.7,25.63 U1.9 ; 18.61,27.52 v1(18.61,27.69)
  Bottom Layer w0.203: v1(18.61,27.69) 18.61,28.49 H1.15
10.1: length 3.8
  Top Layer w0.203: U1.140 24.71,21.75 24.28,21.32 24.28,21.03 v1(23.46,20.21)
  Bottom Layer w0.203: H4.37 24.29,20.21 v1(23.46,20.21)
10.2: length 3.4
  Top Layer w0.203: U1.141 26.52,22.25 v1(27.77,21)
  Bottom Layer w0.203: v1(27.77,21) 28.5,21 H4.3
10.3: length 3.9
  Top Layer w0.203: U1.142 24.78,22.75 23.99,21.96 23.99,21.54 v1(23.46,21.01)
  Bottom Layer w0.203: 23.54,20.96 24.26,20.96 H4.38
10.5: length 3.5
  Top Layer w0.203: v1(27.77,21.8) 26.66,22.91 26.66,22.91 26.43,23.14 26.43,23.14 26.32,23.25 U1.143
  Bottom Layer w0.203: v1(27.77,21.8) 28.5,21.8
10.6: length 3.9
  Top Layer w0.203: v1(23.46,21.81) 23.46,22.38 24.83,23.75 U1.144
  Bottom Layer w0.203: 23.53,21.85 24.18,21.85 24.2,21.83
11.2: length 3.3
  Top Layer w0.203: v1(23.46,17) 24.06,17 24.81,17.75 U1.132
  Bottom Layer w0.203: v1(23.46,17) 24.3,17 H4.33
11.3: length 3.1
  Top Layer w0.203: U1.133 26.4,18.25 26.86,17.8 v1(27.77,17.8)
  Bottom Layer w0.203: H4.7 28.5,17.8 v1(27.77,17.8)
11.6: length 3.4
  Top Layer w0.203: U1.134 24.83,18.75 23.89,17.81 v1(23.46,17.81)
  Bottom Layer w0.203: H4.34 24.29,17.81 v1(23.46,17.81)
11.9: length 3.2
  Top Layer w0.203: U1.135 26.62,19.25 27.28,18.6 v1(27.77,18.6)
  Bottom Layer w0.203: H4.6 28.5,18.6 v1(27.77,18.6)
11.10: length 3.3
  Top Layer w0.203: v1(27.77,19.4) 26.92,20.25 U1.137
  Bottom Layer w0.203: H4.5 28.5,19.4 v1(27.77,19.4)
11.11: length 3.5
  Top Layer w0.203: v1(23.46,19.41) 24.8,20.75 U1.138
  Bottom Layer w0.203: v1(23.46,19.41) 24.29,19.41 H4.36
11.12: length 3.4
  Top Layer w0.203: U1.139 26.72,21.25 v1(27.77,20.2)
  Bottom Layer w0.203: v1(27.77,20.2) 28.5,20.2 H4.4
13.0: length 3.1
  Top Layer w0.203: U1.128 24.74,15.75 24.39,15.4 v1(23.46,15.4)
  Bottom Layer w0.203: v1(23.46,15.4) H4.31
13.1: length 2.9
  Top Layer w0.203: v1(27.77,16.2) 27.72,16.25 U1.129
  Bottom Layer w0.203: H4.9 28.5,16.2 v1(27.77,16.2)
13.2: length 3.2
  Top Layer w0.203: U1.130 24.83,16.75 24.28,16.2 v1(23.46,16.2)
  Bottom Layer w0.203: v1(23.46,16.2) 24.3,16.2
13.3: length 3
  Top Layer w0.203: v1(27.77,17) 26.58,17 26.31,17.27 25.6,17.27 U1.131
  Bottom Layer w0.203: v1(27.77,17) 28.5,17 H4.8
14.0: length 3.2
  Top Layer w0.203: U1.118 24.61,10.75 23.96,11.39 v1(23.46,11.39)
  Bottom Layer w0.203: v1(23.46,11.39) 24.29,11.39 H4.26
14.1: length 3.3
  Top Layer w0.203: U1.119 26.49,11.25 27.43,12.19 v1(27.77,12.19)
  Bottom Layer w0.203: v1(27.77,12.19) 28.49,12.19 H4.14
14.2: length 3.1
  Top Layer w0.203: v1(23.46,12.19) 24.18,12.19 24.62,11.75 U1.120
  Bottom Layer w0.203: v1(23.46,12.19) 24.29,12.19 H4.27
14.3: length 3.2
  Top Layer w0.203: v1(27.77,12.99) 27.22,12.99 26.47,12.25 U1.121
  Bottom Layer w0.203: v1(27.77,12.99) 28.49,12.99 H4.13
14.4: length 3.1
  Top Layer w0.203: 25.58,12.75 24.83,12.75 24.59,13 v1(23.46,13)
  Bottom Layer w0.203: v1(23.46,13) 24.3,13 H4.28
14.5: length 3.1
  Top Layer w0.203: U1.123 26.56,13.25 27.1,13.79 v1(27.77,13.79)
  Bottom Layer w0.203: v1(27.77,13.79) 28.49,13.79 H4.12
14.6: length 3
  Top Layer w0.203: U1.124 25.53,13.8 v1(23.46,13.8)
  Bottom Layer w0.203: v1(23.46,13.8) 24.3,13.8 H4.29
15.0: length 4
  Top Layer w0.203: U1.109 26.33,6.25 27.13,7.05 27.13,7.55 v1(27.77,8.19)
  Bottom Layer w0.203: v1(27.77,8.19) 28.49,8.19 H4.19
15.1: length 3.8
  Top Layer w0.203: v1(23.46,8.19) 23.75,8.19 24.15,7.78 24.15,7.29 24.69,6.75 U1.110
  Bottom Layer w0.203: H4.22 24.29,8.19 v1(23.46,8.19)
15.2: length 3.8
  Top Layer w0.203: U1.111 26.33,7.25 26.92,7.85 26.92,8.14 v1(27.77,8.99)
  Bottom Layer w0.203: v1(27.77,8.99) 28.49,8.99 H4.18
15.3: length 3.5
  Top Layer w0.203: U1.112 25.57,7.76 24.82,7.76 23.59,8.99 v1(23.46,8.99)
  Bottom Layer w0.203: H4.23 24.29,8.99 v1(23.46,8.99)
15.4: length 3.6
  Top Layer w0.203: v1(27.77,9.79) 26.87,8.89 26.87,8.8 26.31,8.23 25.6,8.23 U1.113
  Bottom Layer w0.203: H4.17 28.49,9.79 v1(27.77,9.79)
15.5: length 3.4
  Top Layer w0.203: U1.114 24.83,8.75 23.79,9.79 v1(23.46,9.79)
  Bottom Layer w0.203: v1(23.46,9.79) 24.29,9.79 H4.24
15.6: length 3.5
  Top Layer w0.203: v1(27.77,10.59) 26.43,9.25 U1.115
  Bottom Layer w0.203: v1(27.77,10.59) 28.49,10.59 H4.16
15.7: length 1.9
  Top Layer w0.203: 24.96,9.72 24.93,9.74 24.69,9.74 23.83,10.6 23.41,10.6
  vias: v1(23.46,10.6)
15.8: length 3
  Top Layer w0.203: 25.96,10.25 26.53,10.25 27.62,11.34 27.8,11.34
  Bottom Layer w0.203: 27.73,11.39 27.75,11.37 28.46,11.37
  vias: v1(27.77,11.39)
20.0: length 3
  Top Layer w0.203: v1(16.19,2.23) 16.19,4.36 U1.93
  Bottom Layer w0.203: v1(16.19,2.23) 16.2,2.22 H3.9
20.2: length 3
  Top Layer w0.203: U1.94 16.75,5.4 16.21,5.94 v1(16.21,6.45)
  Bottom Layer w0.203: H3.32 16.21,5.71 v1(16.21,6.45)
20.3: length 3
  Top Layer w0.203: v1(16.99,2.23) 16.99,2.77 17.25,3.03 U1.95
  Bottom Layer w0.203: v1(16.99,2.23) 17,2.23 H3.8
20.6: length 4.9
  Top Layer w0.203: v1(18.81,7.27) 18.81,6.66 19.75,5.73 U1.100
  Bottom Layer w0.203: v1(18.81,7.27) 18.81,7.18 18.59,6.96 18.59,5.71 H3.35
20.7: length 3.3
  Top Layer w0.203: v1(19.4,2.23) 19.4,2.28 20.25,3.13 U1.101
  Bottom Layer w0.203: v1(19.4,2.23) 19.4,2.23 H3.5
20.8: length 4.3
  Top Layer w0.203: v1(19.41,6.86) 19.68,6.59 19.68,6.23 19.99,5.92 20.23,5.92 20.75,5.4 U1.102
  Bottom Layer w0.203: H3.36 19.41,5.71 v1(19.41,6.86)
20.9: length 3.4
  Top Layer w0.203: v1(20.2,2.23) 20.25,2.23 21.25,3.24 U1.103
  Bottom Layer w0.203: v1(20.2,2.23) H3.4
20.10: length 3.6
  Top Layer w0.203: v1(20.21,6.45) 21.16,5.5 21.41,5.5 21.74,5.17 21.74,4.43 U1.104
  Bottom Layer w0.203: v1(20.21,6.45) 20.21,5.71 H3.37
20.11: length 3.5
  Top Layer w0.203: U1.105 22.25,3.44 21.05,2.23 v1(21,2.23)
  Bottom Layer w0.203: v1(21,2.23) 21,1.5
20.12: length 3.8
  Top Layer w0.203: U1.106 22.71,4.46 22.71,5.21 22.41,5.5 21.96,5.5 v1(21.01,6.45)
  Bottom Layer w0.203: v1(21.01,6.45) 21.01,5.71 H3.38
20.13: length 3.5
  Top Layer w0.203: v1(21.8,2.23) 22.91,3.34 22.91,3.34 23.14,3.57 23.14,3.58 23.25,3.68 U1.107
  Bottom Layer w0.203: H3.2 21.8,1.5 v1(21.8,2.23)
20.14: length 4
  Top Layer w0.203: v1(21.81,6.45) 22.45,5.81 23.11,5.81 23.75,5.17 U1.108
  Bottom Layer w0.203: H3.39 21.81,5.71 v1(21.81,6.45)
21.2: length 3
  Top Layer w0.203: v1(12.21,6.45) 12.21,6.02 11.75,5.55 U1.84
  Bottom Layer w0.203: H3.27 12.21,5.71 v1(12.21,6.45)
21.3: length 3.2
  Top Layer w0.203: U1.85 12.25,3.5 12.98,2.77 v1(12.98,2.23)
  Bottom Layer w0.203: v1(12.98,2.23) 13,2.22 H3.13
21.4: length 2.9
  Top Layer w0.203: U1.86 12.7,4.47 12.7,5.54 13.01,5.85 v1(13.01,6.45)
  Bottom Layer w0.203: H3.28 13.01,5.71 v1(13.01,6.45)
21.5: length 3.1
  Top Layer w0.203: U1.87 13.29,4.38 13.29,3.12 13.78,2.63 v1(13.78,2.23)
  Bottom Layer w0.203: v1(13.78,2.23) 13.8,2.22 H3.12
21.6: length 1.5
  Top Layer w0.203: 13.8,6.43 13.75,6.38 13.75,5.02 13.78,4.99
  vias: v1(13.8,6.46)
21.7: length 2.8
  Top Layer w0.203: U1.90 14.75,6.31 v1(14.61,6.45)
  Bottom Layer w0.203: H3.30 14.61,5.71 v1(14.61,6.45)
22.0: length 3.6
  Top Layer w0.203: U1.74 6.75,5.38 7.16,5.79 7.56,5.79 v1(8.22,6.45)
  Bottom Layer w0.203: H3.22 8.22,5.72 v1(8.22,6.45)
22.1: length 3.7
  Top Layer w0.203: v1(9.02,2.03) 8.87,2.03 7.25,3.65 U1.75
  Bottom Layer w0.203: H3.18 9,2.01 v1(9.02,2.03)
22.2: length 2.6
  Top Layer w0.203: U1.76 7.74,4.43 7.75,4.45 7.75,5.17 8.32,5.74 8.51,5.74 v1(8.81,6.03)
  Bottom Layer w0.203: H3.23 8.81,5.89 v1(8.81,6.03)
22.3: length 3.9
  Top Layer w0.203: U1.77 8.25,3.1 8.74,2.61 9.39,2.61 v1(9.77,2.23)
  Bottom Layer w0.203: H3.17 9.8,2.21 v1(9.77,2.23)
23.1: length 4.1
  Top Layer w0.203: U1.73 6.25,3.49 6.97,2.77 7.59,2.77 7.9,2.46 7.9,2.25 v1(8.17,1.98)
  Bottom Layer w0.203: v1(8.17,1.98) 8.2,1.95 H3.19
32.4: length 3.3
  Top Layer w0.203: v1(6.6,8.17) 5.5,7.07 5.5,6.59 5.17,6.25 4.42,6.25
33.4: length 4.6
  Top Layer w0.203: U1.60 5.92,12.25 6.38,12.71 7.2,12.71 v1(7.21,12.73)
  Bottom Layer w0.203: H2.33 6.94,13 v1(7.21,12.73)
33.5: length 3.1
  Top Layer w0.203: v1(2.24,12.23) 2.76,12.23 3.24,11.75 U1.61
  Bottom Layer w0.254: v1(2.24,12.23) 2.21,12.2 H2.7
33.6: length 2.6
  Top Layer w0.203: U1.62 5.68,11.25 v1(6.6,12.18)
33.7: length 3.2
  Top Layer w0.203: U1.63 3.42,10.75 2.75,11.42 v1(2.24,11.42)
  Bottom Layer w0.254: H2.6 2.21,11.4 v1(2.24,11.42)
33.8: length 2.7
  Top Layer w0.203: v1(6.6,11.38) 5.48,10.25 U1.64
33.9: length 3.3
  Top Layer w0.203: v1(2.24,10.62) 2.48,10.62 3.36,9.75 U1.65
  Bottom Layer w0.254: v1(2.24,10.62) 2.21,10.6 H2.5
33.10: length 2.7
  Top Layer w0.203: U1.66 5.28,9.25 v1(6.6,10.57)
33.11: length 3.4
  Top Layer w0.203: U1.67 3.31,8.75 v1(2.24,9.82)
  Bottom Layer w0.254: H2.4 2.21,9.8 v1(2.24,9.82)
33.12: length 3
  Top Layer w0.203: U1.68 5.38,8.25 5.69,8.56 5.69,8.83 6.6,9.74 v1(6.6,9.77)
33.13: length 3.5
  Top Layer w0.203: U1.69 4.4,7.73 3.52,7.73 v1(2.24,9.02)
  Bottom Layer w0.254: v1(2.24,9.02) 2.22,9 H2.3
AN0: length 3
  Top Layer w0.203: v1(2.24,13.83) 3.54,13.83 3.62,13.75 U1.57
  Bottom Layer w0.254: H2.9 2.21,13.8 v1(2.24,13.83)
AN1: length 2.3
  Top Layer w0.203: U1.56 4.45,14.22 5.14,14.22 5.5,14.58 v1(6.6,14.58)
AN2: length 3
  Top Layer w0.203: v1(2.24,14.63) 3.55,14.63 3.67,14.75 U1.55
  Bottom Layer w0.254: H2.10 2.21,14.6 v1(2.24,14.63)
AN3: length 2.2
  Top Layer w0.203: v1(6.6,15.39) 6.47,15.25 U1.54
AN4: length 3.1
  Top Layer w0.203: U1.53 2.55,15.75 v1(2.24,15.43)
  Bottom Layer w0.254: v1(2.24,15.43) 2.2,15.4 H2.11
AN5: length 2.2
  Top Layer w0.203: v1(6.6,16.19) 4.48,16.19 U1.52
AN6: length 2.4
  Top Layer w0.203: U1.51 4.41,16.76 3.05,16.76 2.52,16.23 v1(2.24,16.23)
AN7: length 2.3
  Top Layer w0.203: v1(6.6,16.99) 6.35,17.25 U1.50
AN8: length 2.5
  Top Layer w0.203: U1.49 3.32,17.75 2.61,17.03 v1(2.24,17.03)
AN10: length 2.4
  Top Layer w0.203: v1(6.6,17.79) 6.15,18.25 U1.48
AN11: length 2.6
  Top Layer w0.203: U1.47 3.36,18.75 2.44,17.84 v1(2.24,17.84)
AN12: length 2.5
  Top Layer w0.203: v1(6.6,18.6) 6.25,18.6 5.59,19.25 U1.46
AN13: length 3.4
  Top Layer w0.203: v1(2.24,18.64) 2.74,19.15 2.74,19.15 3.34,19.75 U1.45
  Bottom Layer w0.254: v1(2.24,18.64) 2.2,18.6 H2.15
AN16: length 4.7
  Top Layer w0.203: U1.40 5.4,22.25 6.38,21.27 7.05,21.27 v1(7.16,21.15)
  Bottom Layer w0.203: H2.23 7.01,21 v1(7.16,21.15)
AN17: length 3.8
  Top Layer w0.203: v1(2.24,21.04) 3.1,21.91 3.1,22.2 3.65,22.75 U1.39
  Bottom Layer w0.254: v1(2.24,21.04) 2.19,21 H2.18
AN20: length 2.8
  Top Layer w0.203: U1.38 5.16,23.25 5.26,23.14 5.27,23.14 5.5,22.91 5.5,22.9 v1(6.6,21.8)
AN21: length 4.1
  Top Layer w0.203: U1.37 3.48,23.75 2.98,23.25 2.98,22.59 v1(2.24,21.84)
  Bottom Layer w0.254: H2.19 2.19,21.8 v1(2.24,21.84)
AN24: length 4.2
  Top Layer w0.203: U1.36 6.22,25.55 6.22,24.86 7.21,23.88 7.78,23.88 v1(8.19,23.47)
  Bottom Layer w0.203: 8.25,23.36 8.25,24.25 H1.39
AN25: length 3.7
  Top Layer w0.203: v1(8.2,27.69) 7.31,26.8 7.03,26.8 6.75,26.52 U1.35
  Bottom Layer w0.203: v1(8.2,27.69) 8.2,28.5 H1.2
AN35: length 3.9
  Top Layer w0.203: v1(8.99,23.47) 8.2,24.26 7.83,24.26 7.25,24.83 U1.34
  Bottom Layer w0.203: H1.38 9,23.48 v1(8.99,23.47)
AN36: length 3.4
  Top Layer w0.203: v1(9,27.69) 7.75,26.43 U1.33
  Bottom Layer w0.203: v1(9,27.69) 9,28.5 H1.3
AN37: length 3.7
  Top Layer w0.203: U1.32 8.25,24.83 8.83,24.26 9,24.26 v1(9.79,23.47)
  Bottom Layer w0.203: v1(9.79,23.47) 9.8,23.48 H1.37
AN38: length 3.4
  Top Layer w0.203: U1.31 8.75,25.58 8.75,26.63 v1(9.8,27.69)
  Bottom Layer w0.203: H1.4 9.8,28.5 v1(9.8,27.69)
AN39: length 3.5
  Top Layer w0.203: U1.30 9.25,24.83 10.59,23.49 v1(10.59,23.47)
  Bottom Layer w0.203: H1.36 10.6,23.48 v1(10.59,23.47)
AN44: length 3.3
  Top Layer w0.203: U1.29 9.78,25.61 9.78,26.86 v1(10.6,27.69)
  Bottom Layer w0.203: v1(10.6,27.69) 10.6,28.5 H1.5
AN45: length 3.4
  Top Layer w0.203: U1.28 10.25,24.83 11.39,23.69 v1(11.39,23.47)
  Bottom Layer w0.203: v1(11.39,23.47) 11.4,23.47 H1.35
AN46: length 3.2
  Top Layer w0.203: U1.27 10.75,27.03 v1(11.41,27.69)
  Bottom Layer w0.203: H1.6 11.41,28.49 v1(11.41,27.69)
AN47: length 3.3
  Top Layer w0.203: v1(12.19,23.47) 12.19,23.49 11.68,24 11.68,24.4 11.25,24.83 U1.26
  Bottom Layer w0.203: v1(12.19,23.47) 12.2,23.47 H1.34
AN48: length 3.1
  Top Layer w0.203: U1.25 11.75,27.23 v1(12.21,27.69)
  Bottom Layer w0.203: v1(12.21,27.69) 12.21,28.49 H1.7
AN49: length 4.2
  Top Layer w0.203: U1.24 12.25,25.58 12.25,24.83 12.74,24.34 v1(12.74,23.01)
  Bottom Layer w0.203: H1.33 13,23.27 v1(12.74,23.01)
ESR0: length 3.2
  Top Layer w0.203: v1(17.81,6.45) 17.81,6.22 18.75,5.28 U1.98
  Bottom Layer w0.203: H3.34 17.81,5.71 v1(17.81,6.45)
ESR1: length 3
  Top Layer w0.203: v1(17.01,6.45) 17.01,6.05 17.75,5.31 U1.96
  Bottom Layer w0.203: v1(17.01,6.45) 17.01,5.8
RST: length 3.1
  Top Layer w0.203: U1.97 18.25,3.16 17.79,2.71 v1(17.79,2.23)
  Bottom Layer w0.203: H3.7 17.8,2.23 v1(17.79,2.23)
TCK: length 2.9
  Top Layer w0.203: U1.92 15.75,5.69 15.41,6.02 v1(15.41,6.45)
  Bottom Layer w0.203: v1(15.41,6.45) 15.41,5.71 H3.31
TMS: length 3.1
  Top Layer w0.203: U1.89 14.22,4.39 14.22,3.3 14.59,2.94 v1(14.59,2.23)
  Bottom Layer w0.203: v1(14.59,2.23) 14.6,2.22 H3.11
TRST: length 3
  Top Layer w0.203: U1.91 15.24,4.41 15.24,2.79 15.39,2.65 v1(15.39,2.23)
  Bottom Layer w0.203: v1(15.39,2.23) 15.39,1.51 H3.10
VAGND: length 16.2
  Top Layer w0.203: v1(2.24,20.24) 3.05,21.05 3.05,21.34 3.46,21.75 U1.41 5.28,21.75 6.2,20.82 6.74,20.82 6.94,20.62 7.56,20.62 v1(7.9,20.96)
  Bottom Layer w0.203: v1(7.9,20.96) 7.95,21.01 9.37,21.01 10.3,21.95 12.15,21.95 U4.2 14.99,20.7 R2.2
  Bottom Layer w0.254: v1(2.24,20.24) 2.19,20.2 H2.17
VAREF: length 7.2
  Top Layer w0.203: v1(6.58,20.23) 6.24,20.23 5.22,21.25 U1.42
  Bottom Layer w0.203: v1(6.58,20.23) 8.68,20.23 R1.2
  Bottom Layer w0.254: U4.1 10.6,20.31 R1.2
VGATE1N: length 3.1
  Top Layer w0.203: U1.70 4.46,7.21 5.13,7.21 5.69,7.77 5.69,8.06 v1(6.6,8.97)
VGATE1P: length 3.6
  Top Layer w0.203: v1(2.24,8.22) 3.34,7.12 3.34,6.95 3.54,6.75 U1.71
  Bottom Layer w0.254: H2.2 2.22,8.2 v1(2.24,8.22)
XTAL1: length 9
  Top Layer w0.203: v1(10.61,8.51) 10.25,8.15 U1.81
  Bottom Layer w0.203: X1.3 9.82,12.21 10.79,11.24 10.79,8.7 v1(10.61,8.51)
  Bottom Layer w0.254: v1(10.61,8.51) C18.2
XTAL2: length 7.3
  Top Layer w0.203: v1(11.37,8.51) 10.75,7.89 U1.82
  Bottom Layer w0.203: X1.1 11.37,9.9 v1(11.37,8.51)
  Bottom Layer w0.254: v1(11.37,8.51) C19.1
$1N2544: length 0.9
  Bottom Layer w0.203: v1(1.83,2.9) 2.46,3.53 CORE1.2
$1N12255: length 0.9
  Bottom Layer w0.203: v1(28.2,27.07) 27.6,26.47 CORE2.2
$1N12320: length 0.9
  Bottom Layer w0.203: CORE3.2 27.07,1.87 v1(27.07,1.8)
$1N12385: length 0.9
  Bottom Layer w0.203: v1(2.93,28.2) 3.53,27.6 CORE4.2

## Copper pours and planes (outline as drawn; the poured copper is in the pictures)
GNDCORE on Top Layer: -1.63,30.58 32.51,30.58 32.51,-3.3 -1.63,-3.3
GNDCORE on Bottom Layer: -3.35,33.68 32.66,33.68 32.66,-1.52 -3.35,-1.52

Small or netless copper shapes (teardrops, artwork), in the pictures only: 236 on Top Layer, 116 on Bottom Layer

## Text on the board
Top Layer: YOLO
Top Solder Mask Layer: YOLO
